# Altium schematic sheet [03] - Power supply.SchDoc
size A4
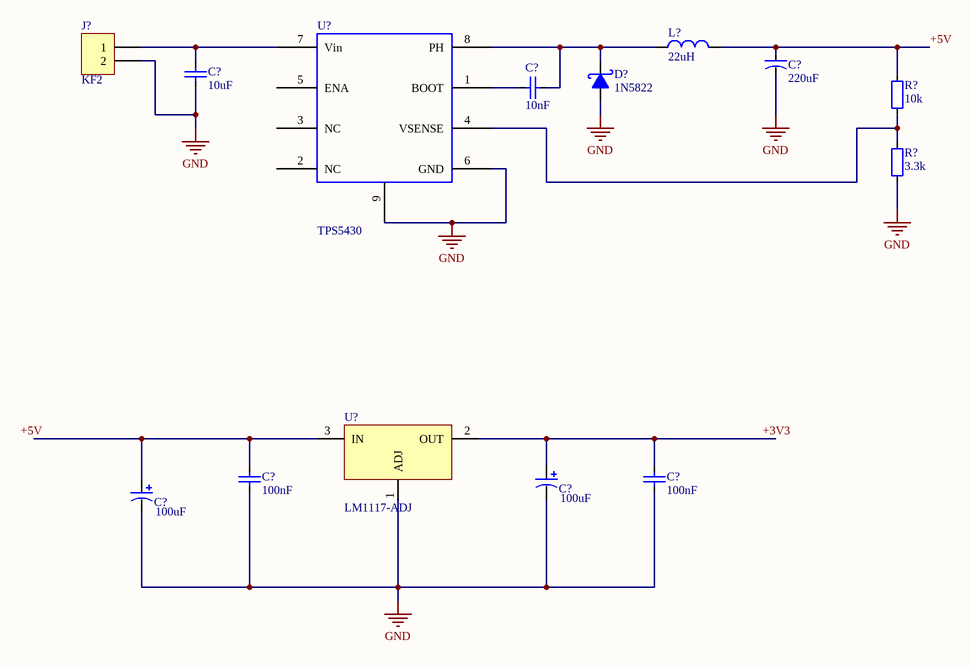
[diagram p0: [03] - Power supply.SchDoc]

## Parts
(Parts that share a designator on the sheet are numbered #1, #2 ... from top to bottom, then left to right.)
C?#1  220uF  [CAP-ALU-SMD-4.5x5x1.4]
C?#2  10nF  [CAP_0402]
C?#3  10uF  [CAP_0402]
C?#4  100uF  [CAP_7343]
C?#5  100uF  [CAP_7343]
C?#6  100nF  [CAP_0402]
C?#7  100nF  [CAP_0402]
D?  1N5822  [DIO-SMD-123]
J?  KF2  [KF2-5.08T]
L?  22uH  [L/0.4]
R?#1  10k  [RES-SMD-0101]
R?#2  3.3k  [RES-SMD-0101]
U?#1  TPS5430  [TPS5430-2]
U?#2  LM1117-ADJ  [LM1117-SOP]

## Nets
GND: C?#1.2 C?#3.1 C?#4.2 C?#5.2 C?#6.1 C?#7.1 D?.1(A) J?.2 R?#2.1 U?#1.6(GND) U?#1.9(PWR_PAD) U?#2.1(ADJ)
+3V3: C?#4.1 C?#7.2 U?#2.2(OUT)
+5V: C?#1.1 L?.2 R?#1.2
NetC?#2_1: C?#2.1 U?#1.1(BOOT)
NetC?#2_2: C?#2.2 D?.2(K) L?.1 U?#1.8(PH)
NetC?#3_2: C?#3.2 J?.1 U?#1.7(Vin)
NetC?#5_1: C?#5.1 C?#6.2 U?#2.3(IN)
NetR?#1_1: R?#1.1 R?#2.2 U?#1.4(VSENSE)

Not connected (* = marked no-connect by the designer): U?#1 2(NC) 3(NC) 5(ENA)

## Notes on the sheet
- Labels drawn without touching a wire or pin: +5V
- Title
- Size:
- Date:
- A4
- Number:
- Time:
- Revision:
- Sheet
- of
- File:

## Library data of the parts
C?#1 = CAP-ALU-SMD: Polarized Capacitor (Axial); Published: 8-Jun-2000; LatestRevisionDate: 17-Jul-2002; LatestRevisionNote: Re-released for DXP Platform.; PackageReference: POLAR0.8; Publisher: Altium Limited
C?#2 C?#3 C?#6 C?#7 = CapSMD: Capacitor; Value: 33p; Published: 8-Jun-2000; LatestRevisionDate: 17-Jul-2002; LatestRevisionNote: Re-released for DXP Platform.; PackageReference: RAD-0.3; Publisher: Altium Limited
C?#4 C?#5 = CAP_TAN_SMD: Polazied Tantalum Capacitor
D? = 1N5822: Schottky Rectifiers; Value: Diode c?m 1N5408
J? = KF2: Manufacturer: Würth Elektronik eiSos GmbH; partNo: 691103110002; ComponentLink1 Description: Manufacturer; ComponentLink2 Description: Datasheet; NoPins: 2; Created Date: 29 October 2013; ComponentLink1URL: http://www.we-online.com; ComponentLink2URL: http://katalog.we-online.de/em/datasheet/6911031100xx.pdf; Created by: Karrer Zheng
L? = L1: Inductor; Value: 150 mH
R?#1 R?#2 = Resistor - SMD: Resistor; Manufacturer: Generic Components; Class: Passive; Published: 08/06/2000; Publisher: Altium Hobart Technology Centre
U?#2 = LM1117-ADJ: 800mA Low-Dropout Linear Regulator; Creator: Nguyen Ba Bien; Website: http://group3i.net
U?#1 = TPS5430: Name: TPS5430